# EasyEDA Pro project ProPrj_mykeyboard_2026-01-25.epro, schematic mykeyboard_1
Board Name: mykeyboard_1; Create Date: 2026-01-01; Page Name: mykeyboard_1; Project Name: mykeyboard; Schematic Name: mykeyboard_1; Update Date: 2026-01-01; File: mykeyboard_1; Id: /; Sheet: /
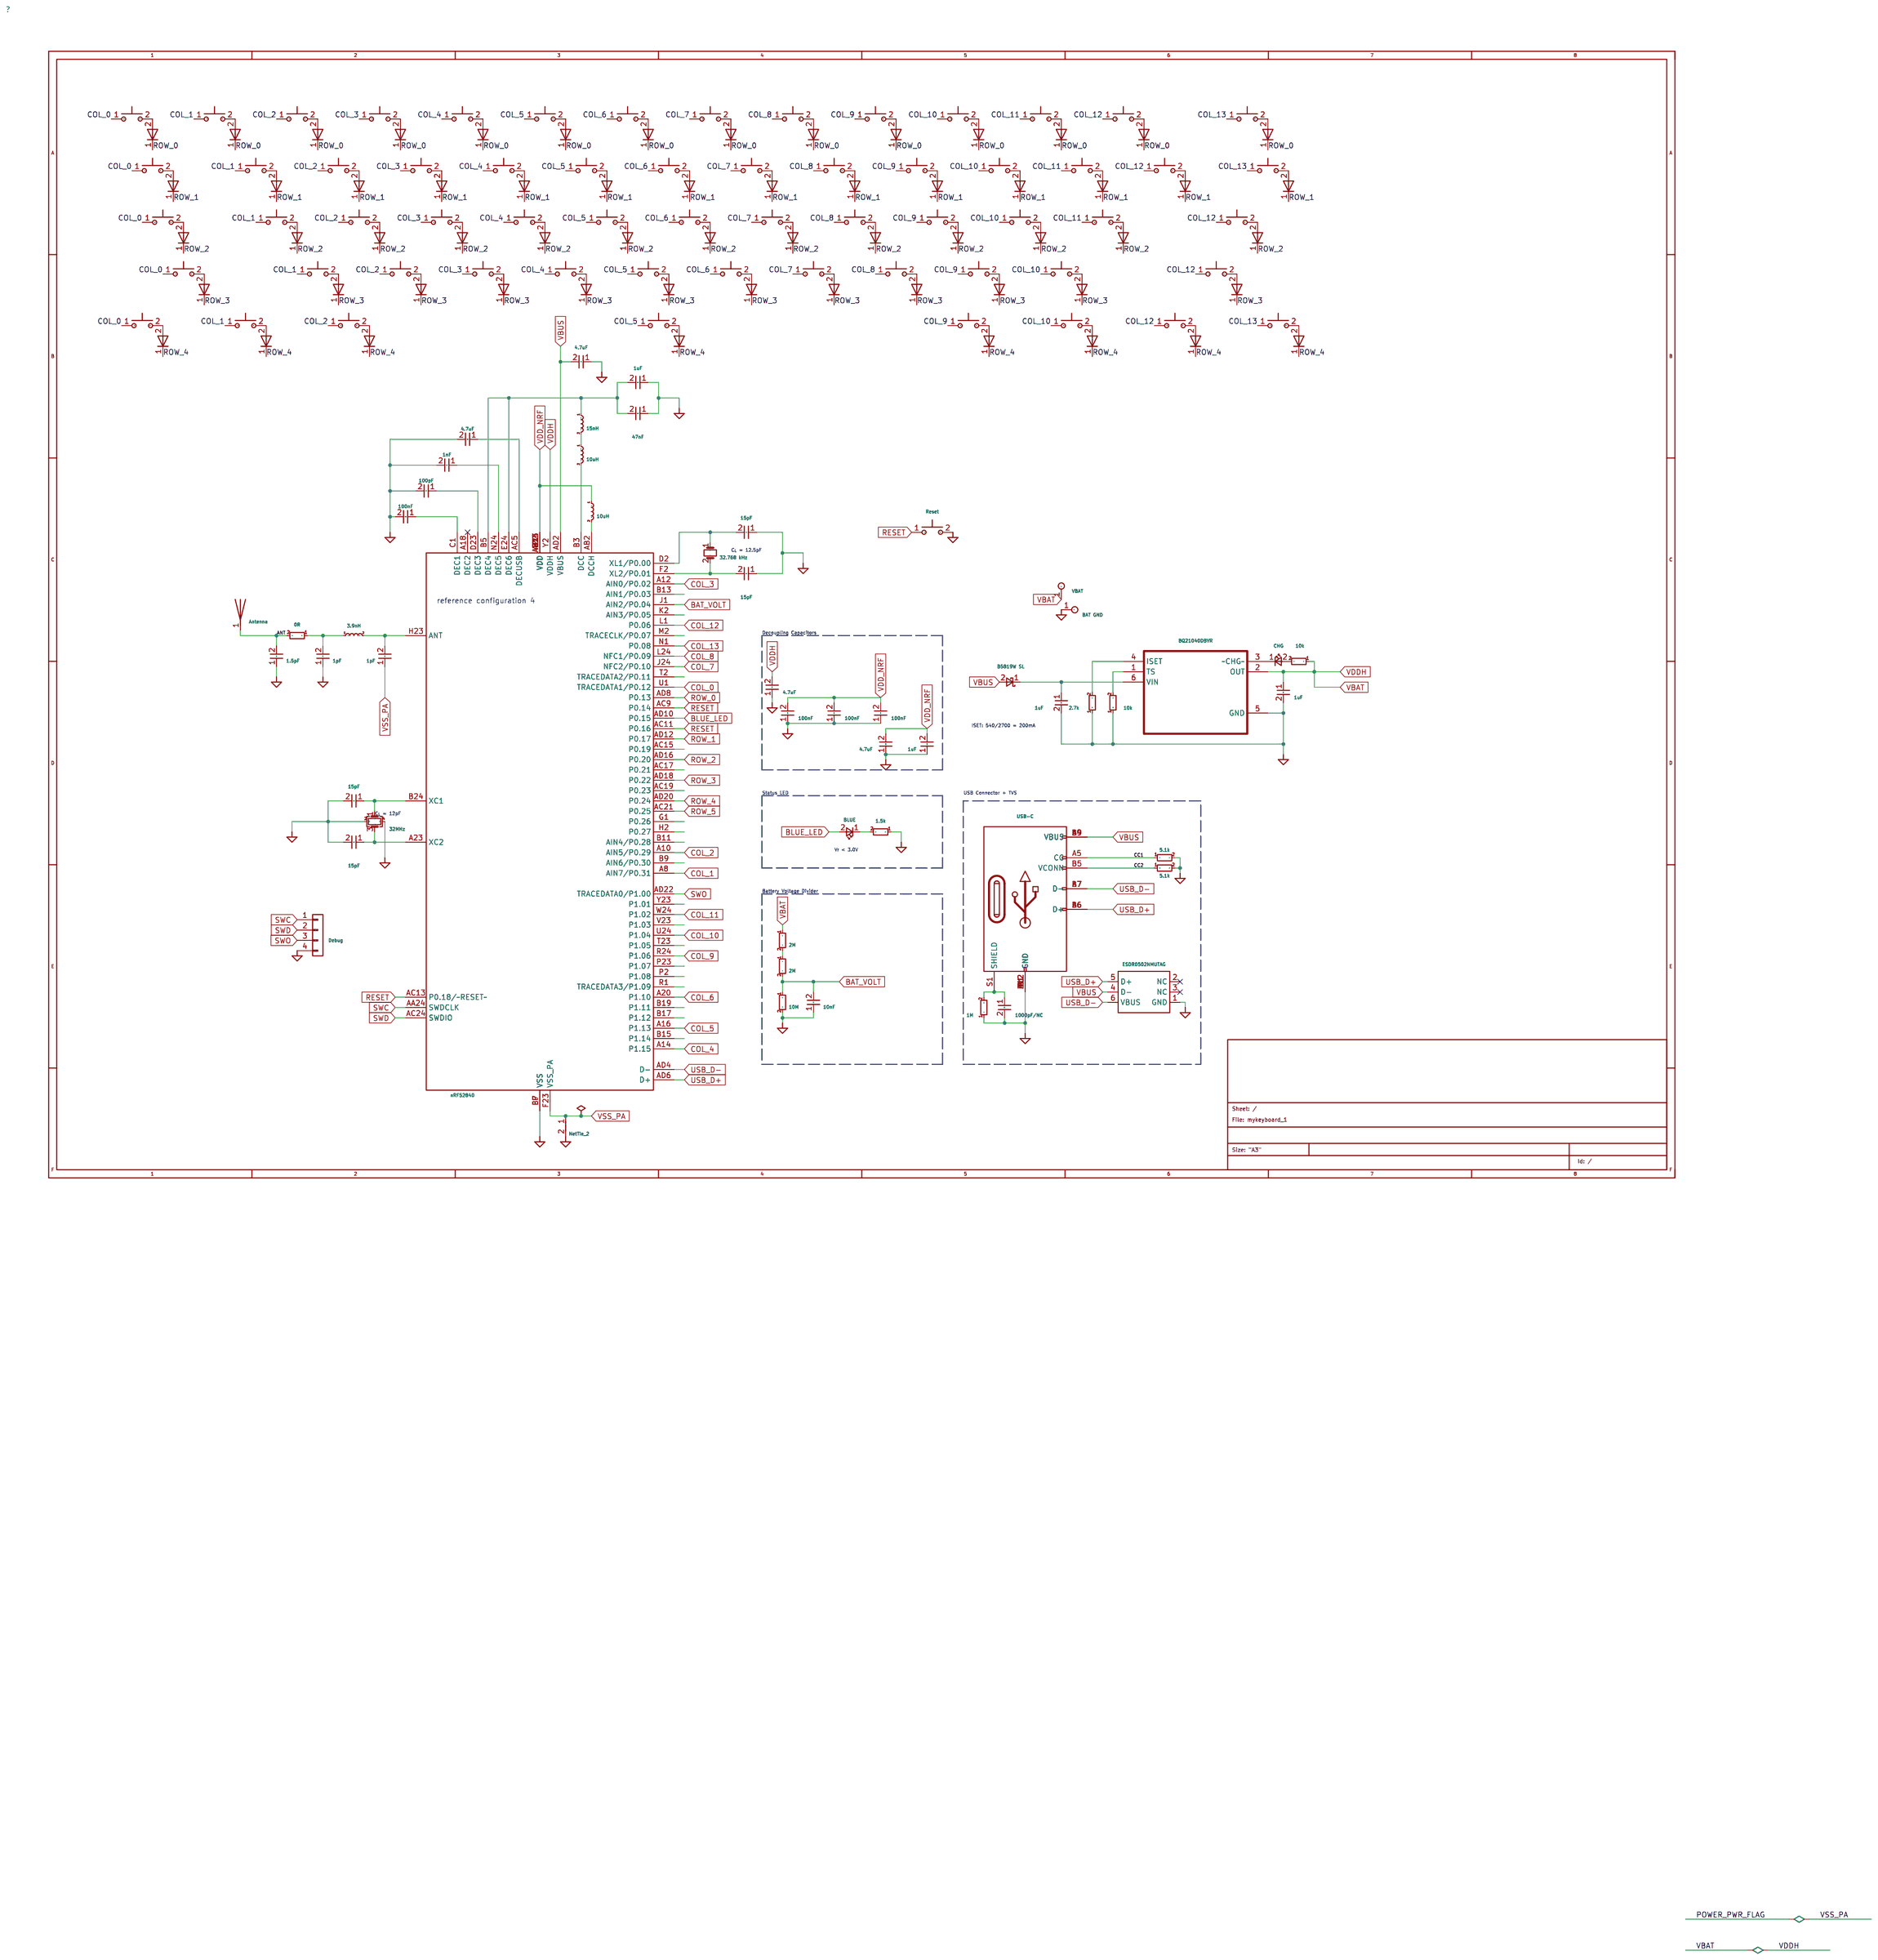
[diagram p0: schematic sheet]

## Parts
AE1  Antenna  [mikoto-footprints:2.4GHz-meander-antenna-v2]
C1  4.7uF  [Capacitor_SMD:C_0402_1005Metric]
C2  1uF  [Capacitor_SMD:C_0402_1005Metric]
C3  47nF  [Capacitor_SMD:C_0402_1005Metric]
C4  4.7uF  [Capacitor_SMD:C_0402_1005Metric]
C5  1nF  [Capacitor_SMD:C_0402_1005Metric]
C6  100pF  [Capacitor_SMD:C_0402_1005Metric]
C7  100nF  [Capacitor_SMD:C_0402_1005Metric]
C8  15pF  [Capacitor_SMD:C_0402_1005Metric]
C9  15pF  [Capacitor_SMD:C_0402_1005Metric]
C10  1.5pF  [Capacitor_SMD:C_0402_1005Metric]
C11  1pF  [Capacitor_SMD:C_0402_1005Metric]
C12  1pF  [Capacitor_SMD:C_0402_1005Metric]
C13  4.7uF  [Capacitor_SMD:C_0402_1005Metric]
C14  1uF  [Capacitor_SMD:C_0402_1005Metric]
C15  1uF  [Capacitor_SMD:C_0402_1005Metric]
C16  100nF  [Capacitor_SMD:C_0402_1005Metric]
C17  100nF  [Capacitor_SMD:C_0402_1005Metric]
C18  100nF  [Capacitor_SMD:C_0402_1005Metric]
C19  4.7uF  [Capacitor_SMD:C_0402_1005Metric]
C20  1uF  [Capacitor_SMD:C_0402_1005Metric]
C21  15pF  [Capacitor_SMD:C_0402_1005Metric]
C22  15pF  [Capacitor_SMD:C_0402_1005Metric]
C23  10nF  [Capacitor_SMD:C_0402_1005Metric]
C24  1000pF/NC  [Capacitor_SMD:C_0402_1005Metric]
D0  D  [Diode_SMD:D_SOD-523]
D1  D  [Diode_SMD:D_SOD-523]
D2  D  [Diode_SMD:D_SOD-523]
D3  D  [Diode_SMD:D_SOD-523]
D4  D  [Diode_SMD:D_SOD-523]
D5  D  [Diode_SMD:D_SOD-523]
D6  D  [Diode_SMD:D_SOD-523]
D7  D  [Diode_SMD:D_SOD-523]
D8  D  [Diode_SMD:D_SOD-523]
D9  D  [Diode_SMD:D_SOD-523]
D10  D  [Diode_SMD:D_SOD-523]
D11  D  [Diode_SMD:D_SOD-523]
D12  D  [Diode_SMD:D_SOD-523]
D13  D  [Diode_SMD:D_SOD-523]
D14  D  [Diode_SMD:D_SOD-523]
D15  D  [Diode_SMD:D_SOD-523]
D16  D  [Diode_SMD:D_SOD-523]
D17  D  [Diode_SMD:D_SOD-523]
D18  D  [Diode_SMD:D_SOD-523]
D19  D  [Diode_SMD:D_SOD-523]
D20  D  [Diode_SMD:D_SOD-523]
D21  D  [Diode_SMD:D_SOD-523]
D22  D  [Diode_SMD:D_SOD-523]
D23  D  [Diode_SMD:D_SOD-523]
D24  D  [Diode_SMD:D_SOD-523]
D25  D  [Diode_SMD:D_SOD-523]
D26  D  [Diode_SMD:D_SOD-523]
D27  D  [Diode_SMD:D_SOD-523]
D28  D  [Diode_SMD:D_SOD-523]
D29  D  [Diode_SMD:D_SOD-523]
D30  D  [Diode_SMD:D_SOD-523]
D31  D  [Diode_SMD:D_SOD-523]
D32  D  [Diode_SMD:D_SOD-523]
D33  D  [Diode_SMD:D_SOD-523]
D34  D  [Diode_SMD:D_SOD-523]
D35  D  [Diode_SMD:D_SOD-523]
D36  D  [Diode_SMD:D_SOD-523]
D37  D  [Diode_SMD:D_SOD-523]
D38  D  [Diode_SMD:D_SOD-523]
D39  D  [Diode_SMD:D_SOD-523]
D40  D  [Diode_SMD:D_SOD-523]
D41  D  [Diode_SMD:D_SOD-523]
D42  D  [Diode_SMD:D_SOD-523]
D43  D  [Diode_SMD:D_SOD-523]
D44  D  [Diode_SMD:D_SOD-523]
D45  D  [Diode_SMD:D_SOD-523]
D46  D  [Diode_SMD:D_SOD-523]
D47  D  [Diode_SMD:D_SOD-523]
D48  D  [Diode_SMD:D_SOD-523]
D49  D  [Diode_SMD:D_SOD-523]
D50  D  [Diode_SMD:D_SOD-523]
D51  D  [Diode_SMD:D_SOD-523]
D52  D  [Diode_SMD:D_SOD-523]
D53  D  [Diode_SMD:D_SOD-523]
D54  D  [Diode_SMD:D_SOD-523]
D55  D  [Diode_SMD:D_SOD-523]
D56  D  [Diode_SMD:D_SOD-523]
D57  D  [Diode_SMD:D_SOD-523]
D58  D  [Diode_SMD:D_SOD-523]
D59  D  [Diode_SMD:D_SOD-523]
D60  D  [Diode_SMD:D_SOD-523]
D61  B5819W SL  [Diode_SMD:D_SOD-323]
D62  CHG  [LED_SMD:LED_0603_1608Metric]
D63  BLUE  [LED_SMD:LED_0603_1608Metric]
J3  Debug  [Connector_PinHeader_2.54mm:PinHeader_1x04_P2.54mm_Vertical]
K0  ,`  [Gateron_KS33_Hotswap:Gateron-KS33-Hotswap-1U]
K1  !,1  [Gateron_KS33_Hotswap:Gateron-KS33-Hotswap-1U]
K2  @,2  [Gateron_KS33_Hotswap:Gateron-KS33-Hotswap-1U]
K3  #,3  [Gateron_KS33_Hotswap:Gateron-KS33-Hotswap-1U]
K4  $,4  [Gateron_KS33_Hotswap:Gateron-KS33-Hotswap-1U]
K5  %,5  [Gateron_KS33_Hotswap:Gateron-KS33-Hotswap-1U]
K6  ^,6  [Gateron_KS33_Hotswap:Gateron-KS33-Hotswap-1U]
K7  &,7  [Gateron_KS33_Hotswap:Gateron-KS33-Hotswap-1U]
K8  *,8  [Gateron_KS33_Hotswap:Gateron-KS33-Hotswap-1U]
K9  (,9  [Gateron_KS33_Hotswap:Gateron-KS33-Hotswap-1U]
K10  ),0  [Gateron_KS33_Hotswap:Gateron-KS33-Hotswap-1U]
K11  _,-  [Gateron_KS33_Hotswap:Gateron-KS33-Hotswap-1U]
K12  +,=  [Gateron_KS33_Hotswap:Gateron-KS33-Hotswap-1U]
K13  Backspace  [Gateron_KS33_Hotswap:Gateron-KS33-Hotswap-2U]
K14  Tab  [Gateron_KS33_Hotswap:Gateron-KS33-Hotswap-1.5U]
K15  Q  [Gateron_KS33_Hotswap:Gateron-KS33-Hotswap-1U]
K16  W  [Gateron_KS33_Hotswap:Gateron-KS33-Hotswap-1U]
K17  E  [Gateron_KS33_Hotswap:Gateron-KS33-Hotswap-1U]
K18  R  [Gateron_KS33_Hotswap:Gateron-KS33-Hotswap-1U]
K19  T  [Gateron_KS33_Hotswap:Gateron-KS33-Hotswap-1U]
K20  Y  [Gateron_KS33_Hotswap:Gateron-KS33-Hotswap-1U]
K21  U  [Gateron_KS33_Hotswap:Gateron-KS33-Hotswap-1U]
K22  I  [Gateron_KS33_Hotswap:Gateron-KS33-Hotswap-1U]
K23  O  [Gateron_KS33_Hotswap:Gateron-KS33-Hotswap-1U]
K24  P  [Gateron_KS33_Hotswap:Gateron-KS33-Hotswap-1U]
K25  {,[  [Gateron_KS33_Hotswap:Gateron-KS33-Hotswap-1U]
K26  },]  [Gateron_KS33_Hotswap:Gateron-KS33-Hotswap-1U]
K27  |,\\  [Gateron_KS33_Hotswap:Gateron-KS33-Hotswap-1.5U]
K28  Caps Lock  [Gateron_KS33_Hotswap:Gateron-KS33-Hotswap-1.75U]
K29  A  [Gateron_KS33_Hotswap:Gateron-KS33-Hotswap-1U]
K30  S  [Gateron_KS33_Hotswap:Gateron-KS33-Hotswap-1U]
K31  D  [Gateron_KS33_Hotswap:Gateron-KS33-Hotswap-1U]
K32  F  [Gateron_KS33_Hotswap:Gateron-KS33-Hotswap-1U]
K33  G  [Gateron_KS33_Hotswap:Gateron-KS33-Hotswap-1U]
K34  H  [Gateron_KS33_Hotswap:Gateron-KS33-Hotswap-1U]
K35  J  [Gateron_KS33_Hotswap:Gateron-KS33-Hotswap-1U]
K36  K  [Gateron_KS33_Hotswap:Gateron-KS33-Hotswap-1U]
K37  L  [Gateron_KS33_Hotswap:Gateron-KS33-Hotswap-1U]
K38  :,;  [Gateron_KS33_Hotswap:Gateron-KS33-Hotswap-1U]
K39  \",'  [Gateron_KS33_Hotswap:Gateron-KS33-Hotswap-1U]
K40  Enter  [Gateron_KS33_Hotswap:Gateron-KS33-Hotswap-2.25U]
K41  Shift  [Gateron_KS33_Hotswap:Gateron-KS33-Hotswap-2.25U]
K42  Z  [Gateron_KS33_Hotswap:Gateron-KS33-Hotswap-1U]
K43  X  [Gateron_KS33_Hotswap:Gateron-KS33-Hotswap-1U]
K44  C  [Gateron_KS33_Hotswap:Gateron-KS33-Hotswap-1U]
K45  V  [Gateron_KS33_Hotswap:Gateron-KS33-Hotswap-1U]
K46  B  [Gateron_KS33_Hotswap:Gateron-KS33-Hotswap-1U]
K47  N  [Gateron_KS33_Hotswap:Gateron-KS33-Hotswap-1U]
K48  M  [Gateron_KS33_Hotswap:Gateron-KS33-Hotswap-1U]
K49  <,,  [Gateron_KS33_Hotswap:Gateron-KS33-Hotswap-1U]
K50  >,.  [Gateron_KS33_Hotswap:Gateron-KS33-Hotswap-1U]
K51  ?,/  [Gateron_KS33_Hotswap:Gateron-KS33-Hotswap-1U]
K52  Shift  [Gateron_KS33_Hotswap:Gateron-KS33-Hotswap-2.75U]
K53  Ctrl  [Gateron_KS33_Hotswap:Gateron-KS33-Hotswap-1.25U]
K54  Win  [Gateron_KS33_Hotswap:Gateron-KS33-Hotswap-1.25U]
K55  Alt  [Gateron_KS33_Hotswap:Gateron-KS33-Hotswap-1.25U]
K56  Blank  [Gateron_KS33_Hotswap:Gateron-KS33-Hotswap-6.25U]
K57  Alt  [Gateron_KS33_Hotswap:Gateron-KS33-Hotswap-1.25U]
K58  Win  [Gateron_KS33_Hotswap:Gateron-KS33-Hotswap-1.25U]
K59  Menu  [Gateron_KS33_Hotswap:Gateron-KS33-Hotswap-1.25U]
K60  Ctrl  [Gateron_KS33_Hotswap:Gateron-KS33-Hotswap-1.25U]
L1  15nH  [Inductor_SMD:L_0402_1005Metric]
L2  10uH  [Inductor_SMD:L_0603_1608Metric]
L3  10uH  [Inductor_SMD:L_0603_1608Metric]
L4  3.9nH  [Inductor_SMD:L_0402_1005Metric]
NT1  NetTie_2  [mikoto-footprints:net-tie-2-tiny]
P1  USB-C  [Connector_USB:USB_C_Receptacle_HRO_TYPE-C-31-M-12]
R1  0R  [Resistor_SMD:R_0402_1005Metric]
R2  10k  [Resistor_SMD:R_0402_1005Metric]
R3  2.7k  [Resistor_SMD:R_0603_1608Metric]
R4  10k  [Resistor_SMD:R_0402_1005Metric]
R5  1.5k  [Resistor_SMD:R_0402_1005Metric]
R6  5.1k  [Resistor_SMD:R_0402_1005Metric]
R7  5.1k  [Resistor_SMD:R_0402_1005Metric]
R8  2M  [Resistor_SMD:R_0603_1608Metric]
R9  2M  [Resistor_SMD:R_0603_1608Metric]
R10  10M  [Resistor_SMD:R_0402_1005Metric]
R11  1M  [Resistor_SMD:R_0402_1005Metric]
SW1  Reset  [Button_Switch_SMD:SW_Push_1P1T_XKB_TS-1187A]
TP5  VBAT  [TestPoint:TestPoint_Pad_2.5x2.5mm]
TP6  BAT GND  [TestPoint:TestPoint_Pad_2.5x2.5mm]
U1  BQ21040DBVR  [BQ21040:SOT95P280X145-6N]
U2  nRF52840  [Package_DFN_QFN:Nordic_AQFN-73-1EP_7x7mm_P0.5mm]
U3  ESDR0502NMUTAG  [mikoto-footprints:UDFN-6_1.2x1.0mm_P0.4mm]
Y1  32.768 kHz  [Crystal:Crystal_SMD_2012-2Pin_2.0x1.2mm]
Y2  32MHz  [Crystal:Crystal_SMD_2016-4Pin_2.0x1.6mm]

## Library data of the parts
AE1 = Device_Antenna
C1 C4 C13 C19 = Device_C_Small: Attribute1: C5; Manufacturer Part: CL05A475KP5NRNC; LCSC: C23733
C2 C14 C15 C20 = Device_C_Small: Attribute1: C5; Manufacturer Part: CL05A105KO5NNNC; LCSC: C52923
C3 = Device_C_Small: Attribute1: C5; Manufacturer Part: CL05B473KO5NNNC; LCSC: C272875
C5 = Device_C_Small: Manufacturer Part: CL05B102KB5NNNC; LCSC: C1523
C6 = Device_C_Small: Attribute1: C5; Manufacturer Part: CL05C101JB5NNNC; LCSC: C1546
C7 C16-C18 = Device_C_Small: Attribute1: C5; Manufacturer Part: CL05B104KA5NNNC; LCSC: C307331
C8 C9 C21 C22 = Device_C_Small: Attribute1: C5; Manufacturer Part: CL05C150JB51PNC; LCSC: C1548
C10 = Device_C_Small: Attribute1: C5; Manufacturer Part: CL05C1R5CB5NNNC; LCSC: C1552
C11 C12 = Device_C_Small: Attribute1: C5; Manufacturer Part: CL05C010CB5NNNC; LCSC: C1550
C23 = Device_C_Small: Attribute1: C5; Manufacturer Part: CL05B103KB5NNNC; LCSC: C15195
C24 = Device_C_Small: Unpolarized capacitor, small symbol; Attribute1: C5; Manufacturer Part: CL05C101JB5NNNC; LCSC: C1546
D0 = Device_D
D1-D60 = Device_D: Attribute1: D0
D61 = Device_D_Schottky_Small: Manufacturer Part: PMEG4010CEJ; LCSC: C8598
D62 = Device_LED_Small: Attribute1: D63; Manufacturer Part: 19-217/S2C-AQ1R1B/3T; LCSC: C72038
D63 = Device_LED_Small: Manufacturer Part: 19-217/BHC-ZL1M2RY/3T; LCSC: C2290
J3 = Connector_Generic_Conn_01x04: Generic connector, single row, 01x04, script generated (kicad-library-utils/schlib/autogen/connector/)
K0-K60 = Switch_SW_Push
L1 = Device_L_Small: Manufacturer Part: MLG1005S15NJT000; LCSC: C27143
L2 = Device_L_Small: Manufacturer Part: MLF1608E100KTD00; LCSC: C285968
L3 = Device_L_Small: Attribute1: L2; Manufacturer Part: MLF1608E100KTD00; LCSC: C285968
L4 = Device_L_Small: Attribute1: L1; Manufacturer Part: MLG1005S3N9BT000; LCSC: C14033
NT1 = Device_NetTie_2
P1 = Connector_USB_C_Plug_USB2.0: USB 2.0-only Type-C Plug connector; Datasheet: https://www.usb.org/sites/default/files/documents/usb_type-c.zip; LCSC: C165948; User doc link: https://www.usb.org/sites/default/files/documents/usb_type-c.zip
R1 = Device_R_Small: Attribute1: R10; Manufacturer Part: RC0402FR-070RL; LCSC: C17168
R2 R4 = Device_R_Small: Attribute1: R10; Manufacturer Part: RC0402FR-0710KL; LCSC: C25744
R3 = Device_R_Small: Attribute1: R9; Manufacturer Part: RC0402FR-0710KL; LCSC: C13167
R5 = Device_R_Small: Attribute1: R10; Manufacturer Part: RC0402FR-071K5L; LCSC: C25867
R6 R7 = Device_R_Small: Attribute1: R10; Manufacturer Part: RC0402FR-075K1L; LCSC: C25905
R8 = Device_R_Small: Attribute1: R9; Manufacturer Part: RC0402FR-072ML; LCSC: C22976
R9 = Device_R_Small: Manufacturer Part: RC0402FR-072ML; LCSC: C22976
R10 = Device_R_Small: Manufacturer Part: RC0402FR-0710ML; LCSC: C26082
R11 = Device_R_Small: Resistor, small symbol; Attribute1: R10; Manufacturer Part: RC0402FR-071K5L; LCSC: C26083
SW1 = Switch_SW_Push: Push button switch, generic, two pins; LCSC: C318884
TP5 TP6 = Connector_TestPoint: test point
U1 = bq21040_BQ21040DBVR: MF: Texas Instruments; Description_1: \n1-cell, 0.8-A Li-ion and Li-polymer battery charger\n; Package1: SOT-23-6 Texas Instruments; Price: None; SnapEDA_Link: https://www.snapeda.com/parts/BQ21040DBVR/Texas+Instruments/view-part/?ref=snap; Purchase-URL: https://www.snapeda.com/api/url_track_click_mouser/?unipart_id=505197&manufacturer=Texas Instruments&part_name=BQ21040DBVR&search_term=None; Availability: In Stock; Check_prices: https://www.snapeda.com/parts/BQ21040DBVR/Texas+Instruments/view-part/?ref=eda; LCSC: C202311
U2 = MCU_Nordic_nRF52840: Datasheet: http://infocenter.nordicsemi.com/topic/com.nordic.infocenter.nrf52/dita/nrf52/chips/nrf52840.html; Manufacturer Part: NRF52840-QIAA-R; LCSC: C190794; User doc link: http://infocenter.nordicsemi.com/topic/com.nordic.infocenter.nrf52/dita/nrf52/chips/nrf52840.html
U3 = mikoto_ESDR0502NMUTAG: Datasheet: http://www.onsemi.cn/pub_link/Collateral/ESDR0502N-D.PDF; Manufacturer Part: ESDR0502NMUTBG; LCSC: C327480; User doc link: http://www.onsemi.cn/pub_link/Collateral/ESDR0502N-D.PDF
Y1 = Device_Crystal_Small: Manufacturer Part: SC20S-12.5PF20PPM; LCSC: C99009
Y2 = Device_Crystal_GND24_Small: Manufacturer Part: Q22FA1280001800; LCSC: C2965584

## Nets
VBAT: C13.2 C14.1 R2.1 R8.1 TP5.1 U1.2(OUT) U2.Y2(VDDH)
VBUS: C1.2 D61.2(A) P1.A4(VBUS) P1.A9(VBUS) P1.B4(VBUS) P1.B9(VBUS) U2.AD2(VBUS) U3.4(D-)
VDD_NRF: C16.2 C17.2 C18.2 C19.2 C20.2 L3.1 U2.A22(VDD) U2.AD14(VDD) U2.AD23(VDD) U2.B1(VDD) U2.W1(VDD)
ANT: AE1.1(A) C10.2 R1.2
BAT_VOLT: C23.2 R9.2 R10.1 U2.J1(AIN2/P0.04)
BLUE_LED: D63.2(A) U2.AD10(P0.15)
CC1: P1.A5(CC) R6.1
CC2: P1.B5(VCONN) R7.1
COL_0: K0.1 K14.1 K28.1 K41.1 K53.1 U2.U1(TRACEDATA1/P0.12)
COL_1: K1.1 K15.1 K29.1 K42.1 K54.1 U2.A8(AIN7/P0.31)
COL_2: K2.1 K16.1 K30.1 K43.1 K55.1 U2.A10(AIN5/P0.29)
COL_3: K3.1 K17.1 K31.1 K44.1 U2.A12(AIN0/P0.02)
COL_4: K4.1 K18.1 K32.1 K45.1 U2.A14(P1.15)
COL_5: K5.1 K19.1 K33.1 K46.1 K56.1 U2.A16(P1.13)
COL_6: K6.1 K20.1 K34.1 K47.1 U2.A20(P1.10)
COL_7: K7.1 K21.1 K35.1 K48.1 U2.J24(NFC2/P0.10)
COL_8: K8.1 K22.1 K36.1 K49.1 U2.L24(NFC1/P0.09)
COL_9: K9.1 K23.1 K37.1 K50.1 K57.1 U2.R24(P1.06)
COL_10: K10.1 K24.1 K38.1 K51.1 K58.1 U2.U24(P1.04)
COL_11: K11.1 K25.1 K39.1 U2.W24(P1.02)
COL_12: K12.1 K26.1 K40.1 K52.1 K59.1 U2.L1(P0.06)
COL_13: K13.1 K27.1 K60.1 U2.N1(P0.08)
POWER_GND: C1.1 C2.1 C3.1 C4.2 C5.2 C6.2 C7.2 C8.1 C9.1 C10.1 C11.1 C13.1 C14.2 C15.2 C16.1 C17.1 C18.1 C19.1 C20.1 C21.2 C22.2 C23.1 C24.2 J3.4(Pin) NT1.2 P1.A1(GND) P1.A12(GND) P1.B1(GND) P1.B12(GND) R3.1 R4.1 R5.1 R6.2 R7.2 R10.2 R11.1 SW1.2 TP6.1 U1.5(GND) U2.B7(VSS) U2.EP(VSS) U3.1(GND) Y2.2 Y2.4
POWER_PWR_FLAG: C12.1 NT1.1 U2.F23(VSS_PA)
RESET: SW1.1 U2.AC9(P0.14) U2.AC11(P0.16) U2.AC13(P0.18/~RESET~)
ROW_0: D0.1(K) D1.1(K) D2.1(K) D3.1(K) D4.1(K) D5.1(K) D6.1(K) D7.1(K) D8.1(K) D9.1(K) D10.1(K) D11.1(K) D12.1(K) D13.1(K) U2.AD8(P0.13)
ROW_1: D14.1(K) D15.1(K) D16.1(K) D17.1(K) D18.1(K) D19.1(K) D20.1(K) D21.1(K) D22.1(K) D23.1(K) D24.1(K) D25.1(K) D26.1(K) D27.1(K) U2.AD12(P0.17)
ROW_2: D28.1(K) D29.1(K) D30.1(K) D31.1(K) D32.1(K) D33.1(K) D34.1(K) D35.1(K) D36.1(K) D37.1(K) D38.1(K) D39.1(K) D40.1(K) U2.AD16(P0.20)
ROW_3: D41.1(K) D42.1(K) D43.1(K) D44.1(K) D45.1(K) D46.1(K) D47.1(K) D48.1(K) D49.1(K) D50.1(K) D51.1(K) D52.1(K) U2.AD18(P0.22)
ROW_4: D53.1(K) D54.1(K) D55.1(K) D56.1(K) D57.1(K) D58.1(K) D59.1(K) D60.1(K) U2.AD20(P0.24)
ROW_5: U2.AC21(P0.25)
SWC: J3.1(Pin) U2.AA24(SWDCLK)
SWD: J3.2(Pin) U2.AC24(SWDIO)
SWO: J3.3(Pin) U2.AD22(TRACEDATA0/P1.00)
USB_D+: P1.A6(D+) P1.B6(D+) U2.AD6(D+) U3.5(D+)
USB_D-: P1.A7(D-) P1.B7(D-) U2.AD4(D-) U3.6(VBUS)
NET-(C11-PAD2): C11.2 L4.1 R1.1
Net-(C24-1): C24.1 P1.S1(SHIELD) R11.2
NET-(D0-A): D0.2(A) K0.2
Net-(D1-2): D1.2(A) K1.2
NET-(D2-A): D2.2(A) K2.2
NET-(D3-A): D3.2(A) K3.2
NET-(D4-A): D4.2(A) K4.2
NET-(D5-A): D5.2(A) K5.2
NET-(D6-A): D6.2(A) K6.2
NET-(D7-A): D7.2(A) K7.2
NET-(D8-A): D8.2(A) K8.2
NET-(D9-A): D9.2(A) K9.2
NET-(D10-A): D10.2(A) K10.2
NET-(D11-A): D11.2(A) K11.2
NET-(D12-A): D12.2(A) K12.2
Net-(D13-2): D13.2(A) K13.2
NET-(D14-A): D14.2(A) K14.2
NET-(D15-A): D15.2(A) K15.2
NET-(D16-A): D16.2(A) K16.2
NET-(D17-A): D17.2(A) K17.2
NET-(D18-A): D18.2(A) K18.2
NET-(D19-A): D19.2(A) K19.2
NET-(D20-A): D20.2(A) K20.2
NET-(D21-A): D21.2(A) K21.2
NET-(D22-A): D22.2(A) K22.2
NET-(D23-A): D23.2(A) K23.2
NET-(D24-A): D24.2(A) K24.2
NET-(D25-A): D25.2(A) K25.2
NET-(D26-A): D26.2(A) K26.2
NET-(D27-A): D27.2(A) K27.2
Net-(D28-2): D28.2(A) K28.2
NET-(D29-A): D29.2(A) K29.2
NET-(D30-A): D30.2(A) K30.2
NET-(D31-A): D31.2(A) K31.2
NET-(D32-A): D32.2(A) K32.2
NET-(D33-A): D33.2(A) K33.2
NET-(D34-A): D34.2(A) K34.2
NET-(D35-A): D35.2(A) K35.2
NET-(D36-A): D36.2(A) K36.2
NET-(D37-A): D37.2(A) K37.2
NET-(D38-A): D38.2(A) K38.2
NET-(D39-A): D39.2(A) K39.2
Net-(D40-2): D40.2(A) K40.2
Net-(D41-2): D41.2(A) K41.2
NET-(D42-A): D42.2(A) K42.2
NET-(D43-A): D43.2(A) K43.2
NET-(D44-A): D44.2(A) K44.2
NET-(D45-A): D45.2(A) K45.2
NET-(D46-A): D46.2(A) K46.2
NET-(D47-A): D47.2(A) K47.2
NET-(D48-A): D48.2(A) K48.2
NET-(D49-A): D49.2(A) K49.2
NET-(D50-A): D50.2(A) K50.2
NET-(D51-A): D51.2(A) K51.2
Net-(D52-2): D52.2(A) K52.2
NET-(D53-A): D53.2(A) K53.2
NET-(D54-A): D54.2(A) K54.2
NET-(D55-A): D55.2(A) K55.2
NET-(D56-A): D56.2(A) K56.2
NET-(D57-A): D57.2(A) K57.2
NET-(D58-A): D58.2(A) K58.2
NET-(D59-A): D59.2(A) K59.2
NET-(D60-A): D60.2(A) K60.2
NET-(D61-K): C15.1 D61.1(K) U1.6(VIN)
NET-(D62-A): D62.2(A) R2.2
NET-(D62-K): D62.1(K) U1.3(~CHG~)
NET-(D63-K): D63.1(K) R5.2
NET-(L1-PAD2): L1.2 L2.1
NET-(R8-PAD2): R8.2 R9.1
NET-(U1-ISET): R3.2 U1.4(ISET)
NET-(U1-TS): R4.2 U1.1(TS)
NET-(U2-ANT): C12.2 L4.2 U2.H23(ANT)
NET-(U2-DCC): L2.2 U2.B3(DCC)
NET-(U2-DCCH): L3.2 U2.AB2(DCCH)
NET-(U2-DEC1): C7.1 U2.C1(DEC1)
NET-(U2-DEC3): C6.1 U2.D23(DEC3)
NET-(U2-DEC4): C2.2 C3.2 L1.1 U2.B5(DEC4) U2.E24(DEC6)
NET-(U2-DEC5): C5.1 U2.N24(DEC5)
NET-(U2-DECUSB): C4.1 U2.AC5(DECUSB)
NET-(U2-XC1): C21.1 U2.B24(XC1) Y2.1
NET-(U2-XC2): C22.1 U2.A23(XC2) Y2.3
NET-(U2-XL1{SLASH}P0.00): C8.2 U2.D2(XL1/P0.00) Y1.1
NET-(U2-XL2{SLASH}P0.01): C9.2 U2.F2(XL2/P0.01) Y1.2

Not connected (* = marked no-connect by the designer): U2 A18(DEC2)* AC15(P0.19) AC17(P0.21) AC19(P0.23) B9(AIN6/P0.30) B11(AIN4/P0.28) B13(AIN1/P0.03) B15(P1.14) B17(P1.12) B19(P1.11) G1(P0.26) H2(P0.27) K2(AIN3/P0.05) M2(TRACECLK/P0.07) P2(P1.08) P23(P1.07) R1(TRACEDATA3/P1.09) T2(TRACEDATA2/P0.11) T23(P1.05) V23(P1.03) Y23(P1.01); U3 2(NC)* 3(NC)*

## Notes on the sheet
- C_{L} = 12.5pF
- reference configuration 4
- Decoupling Capacitors
- ISET: 540/2700 = 200mA
- Status LED
- USB Connector + TVS
- C_{L} = 12pF
- V_{f} < 3.0V
- Battery Voltage Divider
